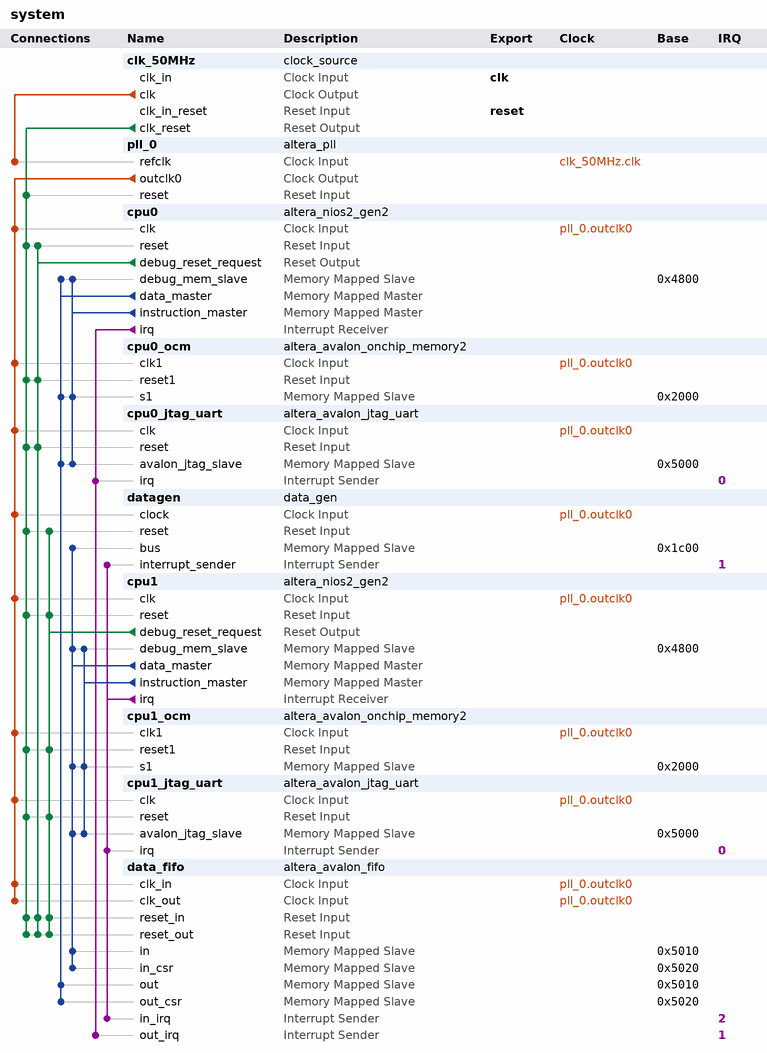
[diagram p0: system contents]
# Platform Designer (Qsys) system system, Cyclone V 5CSEMA5F31C6
# Parameters at their usual value, and those the tool derives, are not listed.
package require -exact qsys 17.0
create_system system
set_project_property DEVICE_FAMILY {Cyclone V}
set_project_property DEVICE 5CSEMA5F31C6

add_instance clk_50MHz clock_source 17.0
set_instance_parameter_value clk_50MHz clockFrequency 50000000

add_instance pll_0 altera_pll 17.0
set_instance_parameter_value pll_0 gui_device_speed_grade 1
set_instance_parameter_value pll_0 gui_number_of_clocks 1
set_instance_parameter_value pll_0 gui_operation_mode direct
set_instance_parameter_value pll_0 gui_output_clock_frequency0 100.0
set_instance_parameter_value pll_0 gui_pll_mode {Integer-N PLL}
set_instance_parameter_value pll_0 gui_reference_clock_frequency 50.0
set_instance_parameter_value pll_0 gui_use_locked false

add_instance cpu0 altera_nios2_gen2 17.0
set_instance_parameter_value cpu0 cpuID 1
set_instance_parameter_value cpu0 dcache_size 2048
set_instance_parameter_value cpu0 exceptionSlave cpu0_ocm.s1
set_instance_parameter_value cpu0 icache_size 4096
set_instance_parameter_value cpu0 impl Fast
set_instance_parameter_value cpu0 resetSlave cpu0_ocm.s1

add_instance cpu0_ocm altera_avalon_onchip_memory2 17.0
set_instance_parameter_value cpu0_ocm dataWidth 32
set_instance_parameter_value cpu0_ocm dualPort false
set_instance_parameter_value cpu0_ocm initMemContent false
set_instance_parameter_value cpu0_ocm initializationFileName onchip_mem.hex
set_instance_parameter_value cpu0_ocm memorySize 8192

add_instance cpu0_jtag_uart altera_avalon_jtag_uart 17.0
set_instance_parameter_value cpu0_jtag_uart simInteractiveOptions NO_INTERACTIVE_WINDOWS

add_instance datagen data_gen 1.1

add_instance cpu1 altera_nios2_gen2 17.0
set_instance_parameter_value cpu1 cpuID 2
set_instance_parameter_value cpu1 dcache_size 2048
set_instance_parameter_value cpu1 exceptionSlave cpu1_ocm.s1
set_instance_parameter_value cpu1 icache_size 4096
set_instance_parameter_value cpu1 impl Fast
set_instance_parameter_value cpu1 resetSlave cpu1_ocm.s1

add_instance cpu1_ocm altera_avalon_onchip_memory2 17.0
set_instance_parameter_value cpu1_ocm dataWidth 32
set_instance_parameter_value cpu1_ocm dualPort false
set_instance_parameter_value cpu1_ocm initMemContent false
set_instance_parameter_value cpu1_ocm initializationFileName onchip_mem.hex
set_instance_parameter_value cpu1_ocm memorySize 8192

add_instance cpu1_jtag_uart altera_avalon_jtag_uart 17.0
set_instance_parameter_value cpu1_jtag_uart simInteractiveOptions NO_INTERACTIVE_WINDOWS

add_instance data_fifo altera_avalon_fifo 17.0
set_instance_parameter_value data_fifo bitsPerSymbol 16
set_instance_parameter_value data_fifo channelWidth 8
set_instance_parameter_value data_fifo errorWidth 8
set_instance_parameter_value data_fifo fifoDepth 16
set_instance_parameter_value data_fifo fifoInputInterfaceOptions AVALONMM_WRITE
set_instance_parameter_value data_fifo fifoOutputInterfaceOptions AVALONMM_READ
set_instance_parameter_value data_fifo singleClockMode false
set_instance_parameter_value data_fifo symbolsPerBeat 2
set_instance_parameter_value data_fifo useIRQ true
set_instance_parameter_value data_fifo usePacket true
set_instance_parameter_value data_fifo useReadControl true

# connections
add_connection clk_50MHz.clk pll_0.refclk clock
add_connection pll_0.outclk0 cpu0.clk clock
add_connection pll_0.outclk0 cpu0_jtag_uart.clk clock
add_connection pll_0.outclk0 cpu0_ocm.clk1 clock
add_connection pll_0.outclk0 cpu1.clk clock
add_connection pll_0.outclk0 cpu1_jtag_uart.clk clock
add_connection pll_0.outclk0 cpu1_ocm.clk1 clock
add_connection pll_0.outclk0 data_fifo.clk_in clock
add_connection pll_0.outclk0 data_fifo.clk_out clock
add_connection pll_0.outclk0 datagen.clock clock
add_connection clk_50MHz.clk_reset cpu0.reset reset
add_connection clk_50MHz.clk_reset cpu0_jtag_uart.reset reset
add_connection clk_50MHz.clk_reset cpu0_ocm.reset1 reset
add_connection clk_50MHz.clk_reset cpu1.reset reset
add_connection clk_50MHz.clk_reset cpu1_jtag_uart.reset reset
add_connection clk_50MHz.clk_reset cpu1_ocm.reset1 reset
add_connection clk_50MHz.clk_reset data_fifo.reset_in reset
add_connection clk_50MHz.clk_reset data_fifo.reset_out reset
add_connection clk_50MHz.clk_reset datagen.reset reset
add_connection clk_50MHz.clk_reset pll_0.reset reset
add_connection cpu0.debug_reset_request cpu0.reset reset
add_connection cpu0.debug_reset_request cpu0_jtag_uart.reset reset
add_connection cpu0.debug_reset_request cpu0_ocm.reset1 reset
add_connection cpu0.debug_reset_request data_fifo.reset_in reset
add_connection cpu0.debug_reset_request data_fifo.reset_out reset
add_connection cpu1.debug_reset_request cpu1.reset reset
add_connection cpu1.debug_reset_request cpu1_jtag_uart.reset reset
add_connection cpu1.debug_reset_request cpu1_ocm.reset1 reset
add_connection cpu1.debug_reset_request data_fifo.reset_in reset
add_connection cpu1.debug_reset_request data_fifo.reset_out reset
add_connection cpu1.debug_reset_request datagen.reset reset
add_connection cpu0.data_master cpu0.debug_mem_slave avalon
set_connection_parameter_value cpu0.data_master/cpu0.debug_mem_slave baseAddress 0x4800
add_connection cpu0.data_master cpu0_jtag_uart.avalon_jtag_slave avalon
set_connection_parameter_value cpu0.data_master/cpu0_jtag_uart.avalon_jtag_slave baseAddress 0x5000
add_connection cpu0.data_master cpu0_ocm.s1 avalon
set_connection_parameter_value cpu0.data_master/cpu0_ocm.s1 baseAddress 0x2000
add_connection cpu0.data_master data_fifo.out avalon
set_connection_parameter_value cpu0.data_master/data_fifo.out baseAddress 0x5010
add_connection cpu0.data_master data_fifo.out_csr avalon
set_connection_parameter_value cpu0.data_master/data_fifo.out_csr baseAddress 0x5020
add_connection cpu0.instruction_master cpu0.debug_mem_slave avalon
set_connection_parameter_value cpu0.instruction_master/cpu0.debug_mem_slave baseAddress 0x4800
add_connection cpu0.instruction_master cpu0_jtag_uart.avalon_jtag_slave avalon
set_connection_parameter_value cpu0.instruction_master/cpu0_jtag_uart.avalon_jtag_slave baseAddress 0x5000
add_connection cpu0.instruction_master cpu0_ocm.s1 avalon
set_connection_parameter_value cpu0.instruction_master/cpu0_ocm.s1 baseAddress 0x2000
add_connection cpu1.data_master cpu1.debug_mem_slave avalon
set_connection_parameter_value cpu1.data_master/cpu1.debug_mem_slave baseAddress 0x4800
add_connection cpu1.data_master cpu1_jtag_uart.avalon_jtag_slave avalon
set_connection_parameter_value cpu1.data_master/cpu1_jtag_uart.avalon_jtag_slave baseAddress 0x5000
add_connection cpu1.data_master cpu1_ocm.s1 avalon
set_connection_parameter_value cpu1.data_master/cpu1_ocm.s1 baseAddress 0x2000
add_connection cpu1.data_master data_fifo.in avalon
set_connection_parameter_value cpu1.data_master/data_fifo.in baseAddress 0x5010
add_connection cpu1.data_master data_fifo.in_csr avalon
set_connection_parameter_value cpu1.data_master/data_fifo.in_csr baseAddress 0x5020
add_connection cpu1.data_master datagen.bus avalon
set_connection_parameter_value cpu1.data_master/datagen.bus baseAddress 0x1c00
add_connection cpu1.instruction_master cpu1.debug_mem_slave avalon
set_connection_parameter_value cpu1.instruction_master/cpu1.debug_mem_slave baseAddress 0x4800
add_connection cpu1.instruction_master cpu1_jtag_uart.avalon_jtag_slave avalon
set_connection_parameter_value cpu1.instruction_master/cpu1_jtag_uart.avalon_jtag_slave baseAddress 0x5000
add_connection cpu1.instruction_master cpu1_ocm.s1 avalon
set_connection_parameter_value cpu1.instruction_master/cpu1_ocm.s1 baseAddress 0x2000
add_connection cpu0.irq cpu0_jtag_uart.irq interrupt
set_connection_parameter_value cpu0.irq/cpu0_jtag_uart.irq irqNumber 0
add_connection cpu0.irq data_fifo.out_irq interrupt
set_connection_parameter_value cpu0.irq/data_fifo.out_irq irqNumber 1
add_connection cpu1.irq cpu1_jtag_uart.irq interrupt
set_connection_parameter_value cpu1.irq/cpu1_jtag_uart.irq irqNumber 0
add_connection cpu1.irq data_fifo.in_irq interrupt
set_connection_parameter_value cpu1.irq/data_fifo.in_irq irqNumber 2
add_connection cpu1.irq datagen.interrupt_sender interrupt
set_connection_parameter_value cpu1.irq/datagen.interrupt_sender irqNumber 1

# exported interfaces
add_interface clk clock sink
set_interface_property clk EXPORT_OF clk_50MHz.clk_in
add_interface reset reset sink
set_interface_property reset EXPORT_OF clk_50MHz.clk_in_reset

set_interconnect_requirement {$system} qsys_mm.clockCrossingAdapter HANDSHAKE
set_interconnect_requirement {$system} qsys_mm.enableEccProtection FALSE
set_interconnect_requirement {$system} qsys_mm.insertDefaultSlave FALSE
set_interconnect_requirement {$system} qsys_mm.maxAdditionalLatency 1

save_system system.qsys
